# Altium schematic sheet VALVEBOARD_ValvePower.SchDoc
size A4; SheetNumber: 4; SheetTotal: 9
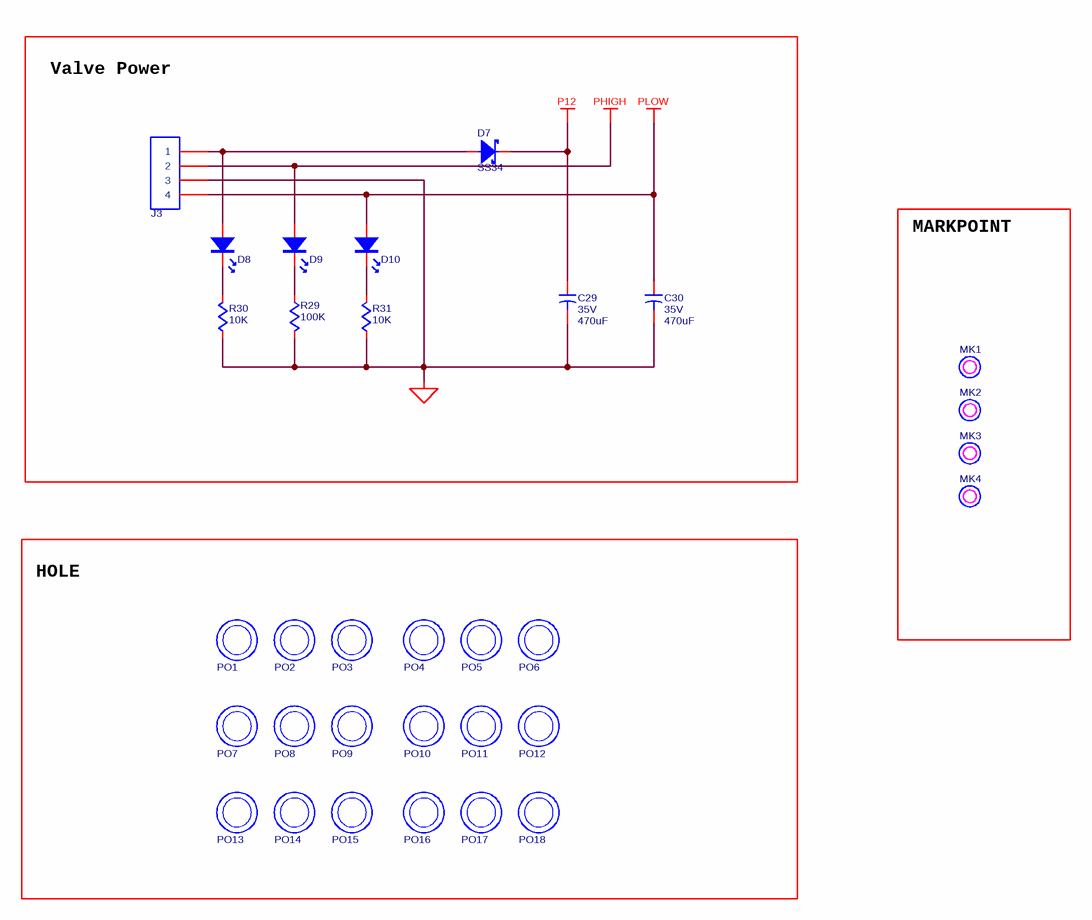
[diagram p0: VALVEBOARD_ValvePower.SchDoc]

## Parts
C29  value 470uF  voltage: 35V  [C_10_10R2]  (hidden comment: C-POL)
C30  value 470uF  voltage: 35V  [C_10_10R2]  (hidden comment: C-POL)
D7  SS34  [SS34]
D8  LED  [LED0603]  (value not drawn)
D9  LED  [LED0603]  (value not drawn)
D10  LED  [LED0603]  (value not drawn)
J3  HDR1X4  [KF301-5.0-4P]  (value not drawn)
MK1  MARKPOINT  [MARKPOINT-1.0]  (value not drawn)
MK2  MARKPOINT  [MARKPOINT-1.0]  (value not drawn)
MK3  MARKPOINT  [MARKPOINT-1.0]  (value not drawn)
MK4  MARKPOINT  [MARKPOINT-1.0]  (value not drawn)
PO1  POSHOLE  [POSHOLE-3.2]  (value not drawn)
PO2  POSHOLE  [POSHOLE-3.2]  (value not drawn)
PO3  POSHOLE  [POSHOLE-3.2]  (value not drawn)
PO4  POSHOLE  [POSHOLE-3.2]  (value not drawn)
PO5  POSHOLE  [POSHOLE-3.2]  (value not drawn)
PO6  POSHOLE  [POSHOLE-3.2]  (value not drawn)
PO7  POSHOLE  [POSHOLE-3.2]  (value not drawn)
PO8  POSHOLE  [POSHOLE-3.2]  (value not drawn)
PO9  POSHOLE  [POSHOLE-3.2]  (value not drawn)
PO10  POSHOLE  [POSHOLE-3.2]  (value not drawn)
PO11  POSHOLE  [POSHOLE-3.2]  (value not drawn)
PO12  POSHOLE  [POSHOLE-3.2]  (value not drawn)
PO13  POSHOLE  [POSHOLE-3.2]  (value not drawn)
PO14  POSHOLE  [POSHOLE-3.2]  (value not drawn)
PO15  POSHOLE  [POSHOLE-3.2]  (value not drawn)
PO16  POSHOLE  [POSHOLE-3.2]  (value not drawn)
PO17  POSHOLE  [POSHOLE-3.2]  (value not drawn)
PO18  POSHOLE  [POSHOLE-3.2]  (value not drawn)
R29  value 100K  [R1206]  (hidden comment: R)
R30  value 10K  [R0805]  (hidden comment: R)
R31  value 10K  [R0805]  (hidden comment: R)

## Blocks framed on the sheet
Valve Power: C29 C30 D7-D10 J3 R29-R31
MARKPOINT: MK1-MK4
HOLE: PO1-PO18

## Nets
P12: C29.1(S) D7.1
PGND: C29.2 C30.2 J3.3 R29.1 R30.2 R31.2
PHIGH: D9.2 J3.2
PLOW: C30.1(S) D10.2 J3.4
NetD7_2: D7.2 D8.2 J3.1
NetD8_1: D8.1 R30.1
NetD9_1: D9.1 R29.2
NetD10_1: D10.1 R31.1

## Library data of the parts
R29-R31 = R: precision: 1%
D7 = SS34: Supplier 1: LCSC; Supplier Part Number 1: C8678